# EAGLE schematic led_transistor (EAGLE 7.1.0)
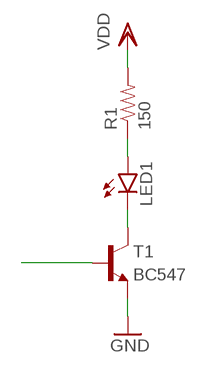
[diagram p0: schematic, sheet 1]

## Parts
LED1  LED5MM  [LED5MM]
R1  150  RESISTORPTH-1/2W  [AXIAL-0.5]
T1  BC547  [TO92]

## Nets
GND: T1.1(E)
N$1: LED1.A R1.P$1
N$2: LED1.K(C) T1.3(C)
N$3: T1.2(B)
VDD: R1.P$2

## Library data of the parts
LED1 = SparkFun-LED:LED: LEDs Standard schematic elements and footprints for 5mm, 3mm, 1206, and 0603 sized LEDs. 5mm - Spark Fun Electronics SKU : COM-00529 (and others)
R1 = SparkFun-Passives:RESISTOR: Resistor Basic schematic elements and footprints for 0603, 1206, and PTH resistors.
T1 = transistor:BC547: NPN TRANSISTOR